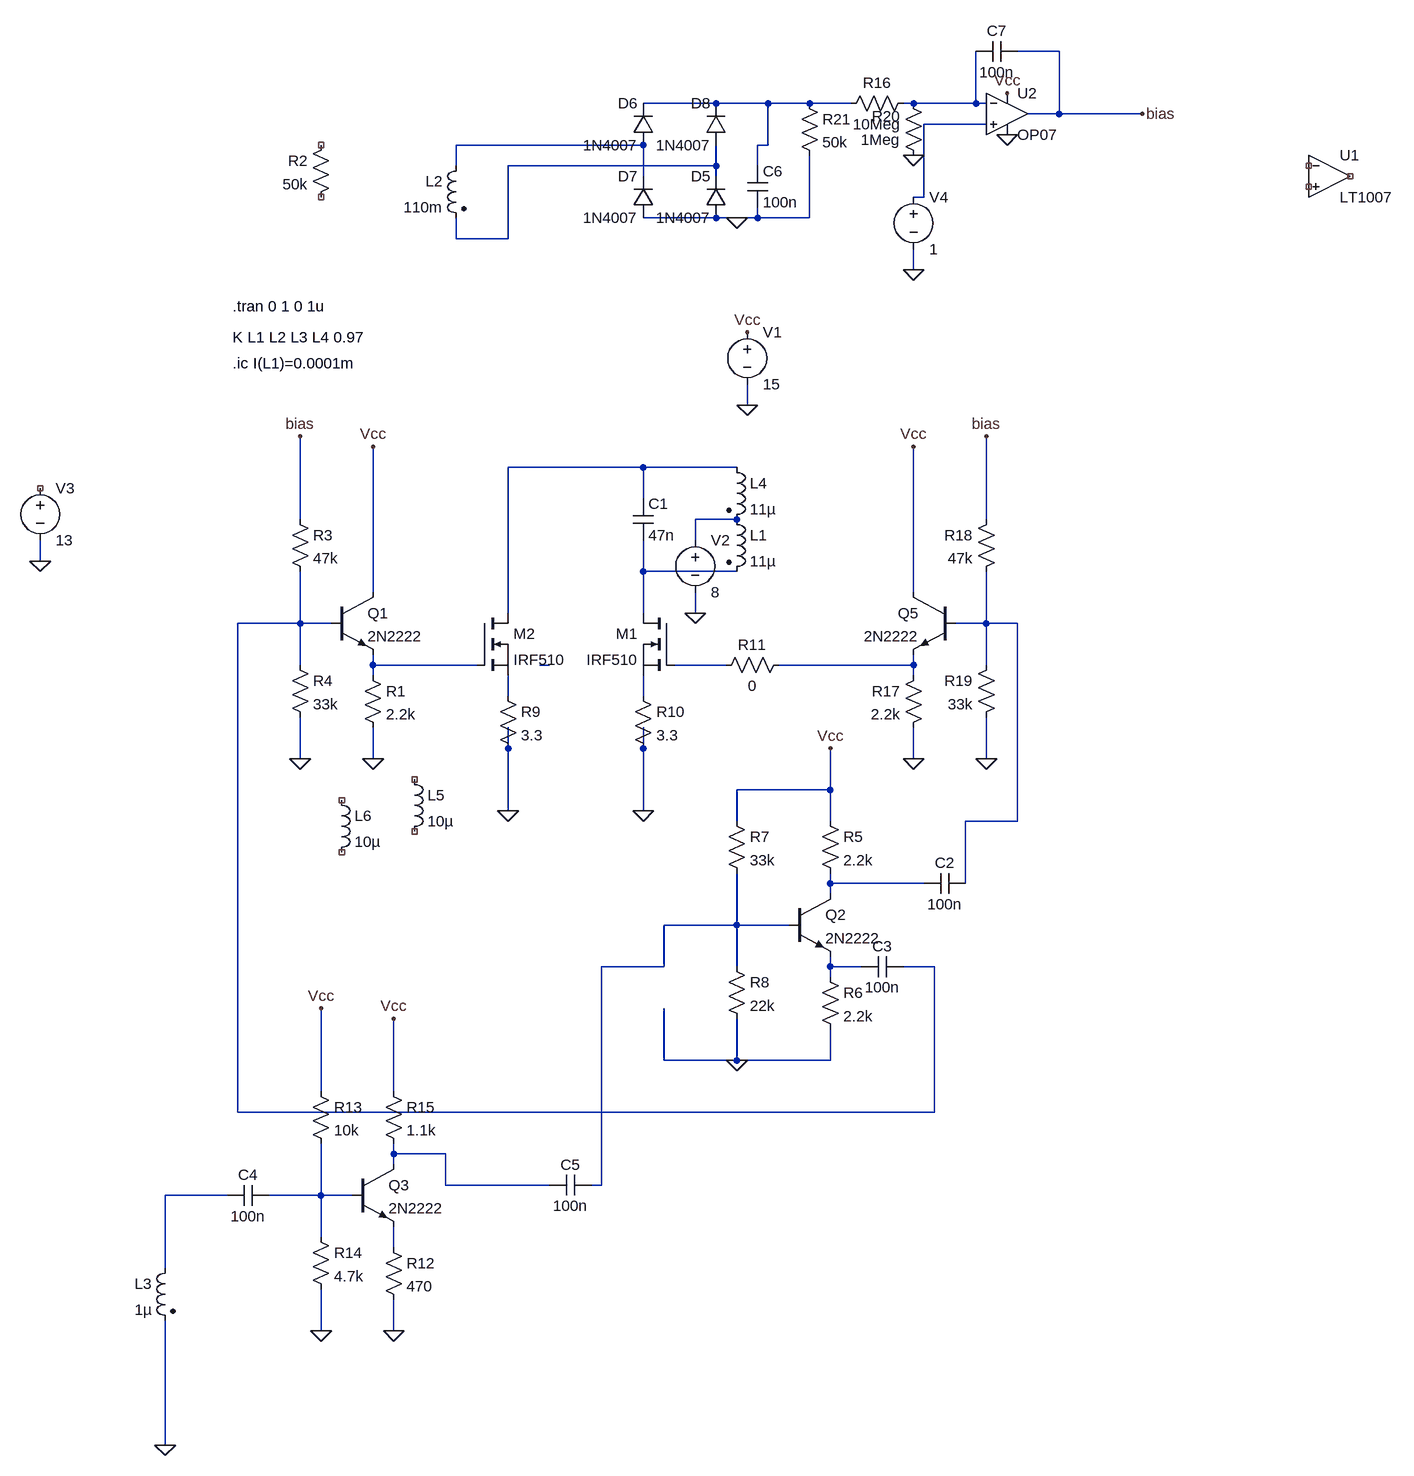
[diagram p0: schematic royer7_mosfet.asc]
royer7_mosfet.asc, the LTspice schematic file:
Version 4
SHEET 1 2216 1780
WIRE 880 -384 816 -384
WIRE 352 -304 240 -304
WIRE 432 -304 352 -304
WIRE 496 -304 432 -304
WIRE 560 -304 496 -304
WIRE 656 -304 640 -304
WIRE 752 -304 752 -384
WIRE 752 -304 656 -304
WIRE 768 -304 752 -304
WIRE 880 -288 880 -384
WIRE 880 -288 832 -288
WIRE 1008 -288 880 -288
WIRE 768 -272 672 -272
WIRE 240 -240 -48 -240
WIRE 432 -240 432 -304
WIRE 432 -240 416 -240
WIRE -48 -208 -48 -240
WIRE 352 -208 352 -240
WIRE 352 -208 32 -208
WIRE 416 -208 416 -240
WIRE 240 -192 240 -240
WIRE 352 -192 352 -208
WIRE 672 -160 672 -272
WIRE 672 -160 656 -160
WIRE 352 -128 240 -128
WIRE 384 -128 352 -128
WIRE 416 -128 416 -144
WIRE 416 -128 384 -128
WIRE 496 -128 496 -224
WIRE 496 -128 416 -128
WIRE -48 -96 -48 -128
WIRE 32 -96 32 -208
WIRE 32 -96 -48 -96
WIRE 656 -48 656 -80
WIRE 400 160 400 128
WIRE 240 256 32 256
WIRE 384 256 240 256
WIRE 240 304 240 256
WIRE -288 336 -288 208
WIRE 384 336 320 336
WIRE 768 336 768 208
WIRE 320 368 320 336
WIRE -688 400 -688 368
WIRE 240 416 240 368
WIRE 384 416 240 416
WIRE -176 448 -176 224
WIRE 656 448 656 224
WIRE 32 480 32 256
WIRE 240 480 240 416
WIRE 320 480 320 448
WIRE -288 496 -288 416
WIRE -288 496 -384 496
WIRE -240 496 -288 496
WIRE 768 496 768 416
WIRE 768 496 720 496
WIRE 816 496 768 496
WIRE -288 560 -288 496
WIRE -176 560 -176 544
WIRE -16 560 -176 560
WIRE 96 560 80 560
WIRE 368 560 288 560
WIRE 656 560 656 544
WIRE 656 560 448 560
WIRE 768 560 768 496
WIRE -176 576 -176 560
WIRE 656 576 656 560
WIRE 32 608 32 576
WIRE 240 608 240 576
WIRE 32 688 32 656
WIRE 240 688 240 656
WIRE -288 704 -288 640
WIRE -176 704 -176 656
WIRE 656 704 656 656
WIRE 768 704 768 640
WIRE 528 752 528 688
WIRE 528 752 384 752
WIRE 32 784 32 688
WIRE 240 784 240 688
WIRE 384 800 384 752
WIRE 528 800 528 752
WIRE 816 800 816 496
WIRE 816 800 736 800
WIRE 528 896 528 880
WIRE 672 896 528 896
WIRE 736 896 736 800
WIRE 528 912 528 896
WIRE 384 960 384 880
WIRE 384 960 272 960
WIRE 464 960 384 960
WIRE 272 1024 272 960
WIRE 272 1024 176 1024
WIRE 384 1024 384 960
WIRE 528 1024 528 1008
WIRE 576 1024 528 1024
WIRE 688 1024 640 1024
WIRE 528 1040 528 1024
WIRE 272 1168 272 1088
WIRE 384 1168 384 1104
WIRE 384 1168 272 1168
WIRE 528 1168 528 1120
WIRE 528 1168 384 1168
WIRE -256 1216 -256 1088
WIRE -144 1216 -144 1104
WIRE -384 1248 -384 496
WIRE 688 1248 688 1024
WIRE 688 1248 -384 1248
WIRE -144 1312 -144 1296
WIRE -64 1312 -144 1312
WIRE -144 1328 -144 1312
WIRE -64 1360 -64 1312
WIRE 96 1360 -64 1360
WIRE 176 1360 176 1024
WIRE 176 1360 160 1360
WIRE -400 1376 -496 1376
WIRE -256 1376 -256 1296
WIRE -256 1376 -336 1376
WIRE -208 1376 -256 1376
WIRE -256 1440 -256 1376
WIRE -144 1456 -144 1424
WIRE -496 1488 -496 1376
WIRE -256 1584 -256 1520
WIRE -144 1584 -144 1536
WIRE -496 1760 -496 1568
FLAG 400 160 0
FLAG 400 48 Vcc
FLAG 384 -128 0
FLAG 384 1168 0
FLAG 528 688 Vcc
FLAG 240 784 0
FLAG 656 224 Vcc
FLAG 656 704 0
FLAG 768 704 0
FLAG -176 224 Vcc
FLAG -176 704 0
FLAG -288 704 0
FLAG 32 784 0
FLAG 320 480 0
FLAG -144 1104 Vcc
FLAG -144 1584 0
FLAG -256 1584 0
FLAG -256 1088 Vcc
FLAG -496 1760 0
FLAG -688 400 0
FLAG 1008 -288 bias
FLAG -288 208 bias
FLAG 768 208 bias
FLAG 800 -320 Vcc
FLAG 800 -256 0
FLAG 656 -48 0
FLAG 656 -224 0
SYMBOL voltage 400 32 R0
WINDOW 123 0 0 Left 0
WINDOW 39 0 0 Left 0
SYMATTR InstName V1
SYMATTR Value 15
SYMBOL ind2 368 320 R0
SYMATTR InstName L1
SYMATTR Value 11µ
SYMATTR Type ind
SYMBOL ind2 -32 -224 M0
SYMATTR InstName L2
SYMATTR Value 110m
SYMATTR Type ind
SYMATTR SpiceLine Rser=5
SYMBOL ind2 -480 1472 M0
SYMATTR InstName L3
SYMATTR Value 1µ
SYMATTR Type ind
SYMATTR SpiceLine Rser=0.1
SYMBOL ind2 368 240 R0
SYMATTR InstName L4
SYMATTR Value 11µ
SYMATTR Type ind
SYMBOL cap 224 304 R0
SYMATTR InstName C1
SYMATTR Value 47n
SYMBOL res -240 -256 M0
SYMATTR InstName R2
SYMATTR Value 50k
SYMBOL npn 464 912 R0
SYMATTR InstName Q2
SYMATTR Value 2N2222
SYMBOL res 512 784 R0
SYMATTR InstName R5
SYMATTR Value 2.2k
SYMBOL res 512 1024 R0
SYMATTR InstName R6
SYMATTR Value 2.2k
SYMBOL res 368 784 R0
SYMATTR InstName R7
SYMATTR Value 33k
SYMBOL res 368 1008 R0
SYMATTR InstName R8
SYMATTR Value 22k
SYMBOL cap -400 1360 M90
WINDOW 0 0 32 VBottom 2
WINDOW 3 32 32 VTop 2
SYMATTR InstName C4
SYMATTR Value 100n
SYMBOL cap 736 880 R90
WINDOW 0 0 32 VBottom 2
WINDOW 3 32 32 VTop 2
SYMATTR InstName C2
SYMATTR Value 100n
SYMBOL cap 640 1008 R90
WINDOW 0 0 32 VBottom 2
WINDOW 3 32 32 VTop 2
SYMATTR InstName C3
SYMATTR Value 100n
SYMBOL npn 720 448 M0
SYMATTR InstName Q5
SYMATTR Value 2N2222
SYMBOL res 672 560 M0
SYMATTR InstName R17
SYMATTR Value 2.2k
SYMBOL res 784 320 M0
SYMATTR InstName R18
SYMATTR Value 47k
SYMBOL res 784 544 M0
SYMATTR InstName R19
SYMATTR Value 33k
SYMBOL nmos 288 480 M0
SYMATTR InstName M1
SYMATTR Value IRF510
SYMBOL nmos -16 480 R0
SYMATTR InstName M2
SYMATTR Value IRF510
SYMBOL npn -240 448 R0
SYMATTR InstName Q1
SYMATTR Value 2N2222
SYMBOL res -192 560 R0
SYMATTR InstName R1
SYMATTR Value 2.2k
SYMBOL res -304 320 R0
SYMATTR InstName R3
SYMATTR Value 47k
SYMBOL res -304 544 R0
SYMATTR InstName R4
SYMATTR Value 33k
SYMBOL ind -128 720 R0
SYMATTR InstName L5
SYMATTR Value 10µ
SYMBOL res 16 592 R0
SYMATTR InstName R9
SYMATTR Value 3.3
SYMBOL res 224 592 R0
SYMATTR InstName R10
SYMATTR Value 3.3
SYMBOL ind -240 752 R0
SYMATTR InstName L6
SYMATTR Value 10µ
SYMBOL res 464 544 R90
WINDOW 0 0 56 VBottom 2
WINDOW 3 32 56 VTop 2
SYMATTR InstName R11
SYMATTR Value 0
SYMBOL voltage 320 352 R0
WINDOW 123 0 0 Left 0
WINDOW 39 0 0 Left 0
SYMATTR InstName V2
SYMATTR Value 8
SYMBOL npn -208 1328 R0
SYMATTR InstName Q3
SYMATTR Value 2N2222
SYMBOL res -160 1440 R0
SYMATTR InstName R12
SYMATTR Value 470
SYMBOL res -272 1200 R0
SYMATTR InstName R13
SYMATTR Value 10k
SYMBOL res -272 1424 R0
SYMATTR InstName R14
SYMATTR Value 4.7k
SYMBOL cap 96 1344 M90
WINDOW 0 0 32 VBottom 2
WINDOW 3 32 32 VTop 2
SYMATTR InstName C5
SYMATTR Value 100n
SYMBOL res -160 1200 R0
SYMATTR InstName R15
SYMATTR Value 1.1k
SYMBOL voltage -688 272 R0
WINDOW 123 0 0 Left 0
WINDOW 39 0 0 Left 0
SYMATTR InstName V3
SYMATTR Value 13
SYMBOL OpAmps\\LT1007 1296 -256 R0
SYMATTR InstName U1
SYMBOL cap 400 -208 R0
SYMATTR InstName C6
SYMATTR Value 100n
SYMBOL diode 368 -128 R180
WINDOW 0 24 64 Left 2
WINDOW 3 24 0 Left 2
SYMATTR InstName D5
SYMATTR Value 1N4007
SYMBOL diode 256 -240 R180
WINDOW 0 24 64 Left 2
WINDOW 3 24 0 Left 2
SYMATTR InstName D6
SYMATTR Value 1N4007
SYMBOL diode 256 -128 R180
WINDOW 0 24 64 Left 2
WINDOW 3 24 0 Left 2
SYMATTR InstName D7
SYMATTR Value 1N4007
SYMBOL diode 368 -240 R180
WINDOW 0 24 64 Left 2
WINDOW 3 24 0 Left 2
SYMATTR InstName D8
SYMATTR Value 1N4007
SYMBOL res 656 -320 R90
WINDOW 0 0 56 VBottom 2
WINDOW 3 32 56 VTop 2
SYMATTR InstName R16
SYMATTR Value 10Meg
SYMBOL voltage 656 -176 R0
WINDOW 123 0 0 Left 0
WINDOW 39 0 0 Left 0
SYMATTR InstName V4
SYMATTR Value 1
SYMBOL cap 816 -400 R90
WINDOW 0 0 32 VBottom 2
WINDOW 3 32 32 VTop 2
SYMATTR InstName C7
SYMATTR Value 100n
SYMBOL OpAmps\\OP07 800 -352 R0
SYMATTR InstName U2
SYMBOL res 672 -208 R180
WINDOW 0 36 76 Left 2
WINDOW 3 36 40 Left 2
SYMATTR InstName R20
SYMATTR Value 1Meg
SYMBOL res 480 -320 R0
SYMATTR InstName R21
SYMATTR Value 50k
TEXT -392 56 Left 2 !K L1 L2 L3 L4 0.97
TEXT -392 8 Left 2 !.tran 0 1 0 1u
TEXT -392 96 Left 2 !.ic I(L1)=0.0001m

The netlist it stands for:
* royer7_mosfet.asc
V1 Vcc 0 15
L1 N007 N008 11µ
L2 N004 N005 110m Rser=5
L3 N021 0 1µ Rser=0.1
L4 N006 N007 11µ
C1 N006 N008 47n
R2 NC_01 NC_02 50k
Q2 N017 N018 N019 0 2N2222
R5 Vcc N017 2.2k
R6 N019 0 2.2k
R7 Vcc N018 33k
R8 N018 0 22k
C4 N021 N022 100n
C2 N010 N017 100n
C3 N009 N019 100n
Q5 Vcc N010 N014 0 2N2222
R17 N014 0 2.2k
R18 bias N010 47k
R19 N010 0 33k
M1 N008 N013 N016 N016 IRF510
M2 N006 N011 N015 N015 IRF510
Q1 Vcc N009 N011 0 2N2222
R1 N011 0 2.2k
R3 bias N009 47k
R4 N009 0 33k
L5 NC_03 NC_04 10µ
R9 N015 0 3.3
R10 N016 0 3.3
L6 NC_05 NC_06 10µ
R11 N014 N013 0
V2 N007 0 8
Q3 N020 N022 N023 0 2N2222
R12 N023 0 470
R13 Vcc N022 10k
R14 N022 0 4.7k
C5 N020 N018 100n
R15 Vcc N020 1.1k
V3 NC_07 0 13
XU1 NC_08 NC_09 NC_10 NC_11 NC_12 LT1007  ; pins In+ In- V+ V- OUT
C6 N001 0 100n
D5 0 N005 1N4007
D6 N004 N001 1N4007
D7 0 N004 1N4007
D8 N005 N001 1N4007
R16 N002 N001 10Meg
V4 N003 0 1
C7 bias N002 100n
XU2 N003 N002 Vcc 0 bias LT1001  ; OP07, pins In+ In- V+ V- OUT
R20 0 N002 1Meg
R21 N001 0 50k
.model D D
.lib standard.dio
.model NPN NPN
.model PNP PNP
.lib standard.bjt
.model NMOS NMOS
.model PMOS PMOS
.lib standard.mos
K L1 L2 L3 L4 0.97
.tran 0 1 0 1u
.ic I(L1)=0.0001m
.lib LTC.lib
.backanno
.end